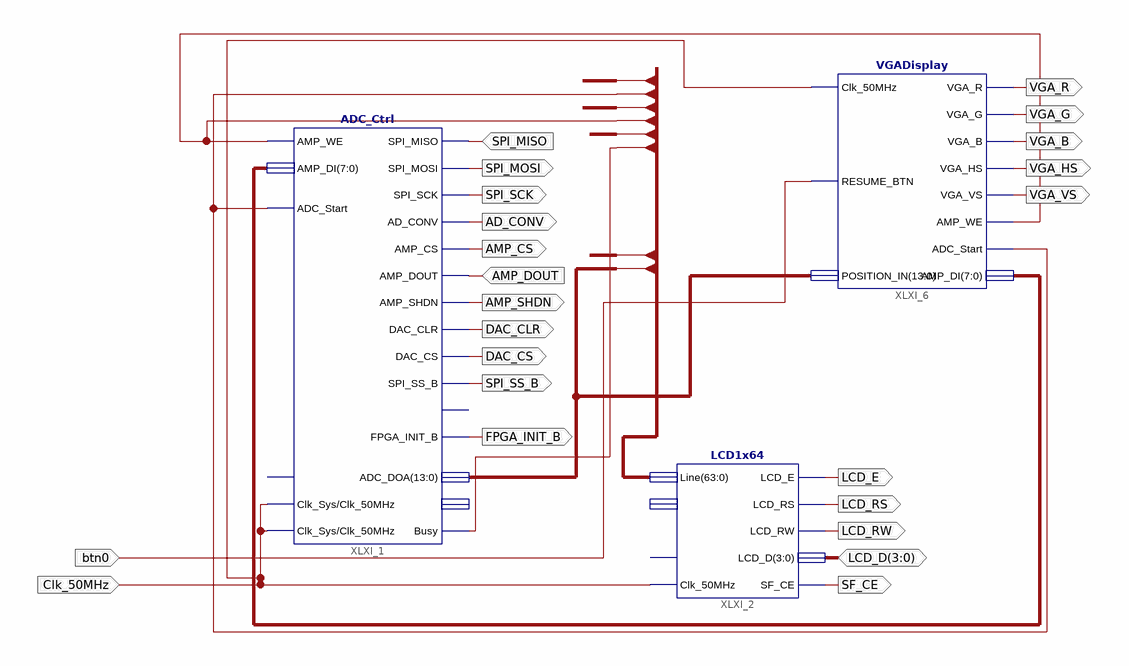
[diagram p0: schematic sheet 1]
// Xilinx ISE schematic adc_test.sch (spartan3e) as structural Verilog: 3 symbols, 23 ports
module adc_test (
  input  Clk_50MHz,
  input  SPI_MISO,
  input  AMP_DOUT,
  input  btn0,
  inout  [3:0] LCD_D,
  output SPI_MOSI,
  output SPI_SCK,
  output AD_CONV,
  output AMP_CS,
  output AMP_SHDN,
  output DAC_CLR,
  output DAC_CS,
  output SPI_SS_B,
  output FPGA_INIT_B,
  output VGA_R,
  output VGA_G,
  output VGA_B,
  output VGA_HS,
  output VGA_VS,
  output LCD_E,
  output LCD_RS,
  output LCD_RW,
  output SF_CE
);

  wire [7:0] XLXN_33;
  wire [63:0] Line;

  ADC_Ctrl XLXI_1 (
    .Clk_Sys(Clk_50MHz), .AMP_WE(Line[56]), .ADC_Start(Line[60]), .SPI_MISO(SPI_MISO), .AMP_DOUT(AMP_DOUT),
    .AMP_DI(XLXN_33), .Busy(Line[52]), .SPI_MOSI(SPI_MOSI), .SPI_SCK(SPI_SCK), .AMP_CS(AMP_CS),
    .AMP_SHDN(AMP_SHDN), .AD_CONV(AD_CONV), .DAC_CS(DAC_CS), .DAC_CLR(DAC_CLR), .SPI_SS_B(SPI_SS_B),
    .FPGA_INIT_B(FPGA_INIT_B), .ADC_DOA(Line[13:0]), .Clk_50MHz(Clk_50MHz));  // open: SF_CE0, ADC_DOB, Reset
  VGADisplay XLXI_6 (
    .Clk_50MHz(Clk_50MHz), .RESUME_BTN(btn0), .POSITION_IN(Line[13:0]), .VGA_R(VGA_R), .VGA_G(VGA_G),
    .VGA_B(VGA_B), .VGA_HS(VGA_HS), .VGA_VS(VGA_VS), .AMP_WE(Line[56]), .ADC_Start(Line[60]), .AMP_DI(XLXN_33));
  LCD1x64 XLXI_2 (
    .Clk_50MHz(Clk_50MHz), .Line(Line), .LCD_D(LCD_D), .LCD_E(LCD_E), .LCD_RW(LCD_RW), .LCD_RS(LCD_RS),
    .SF_CE(SF_CE));  // open: Reset, Blank
endmodule
